# Altium schematic sheet ZOWI_Main_Board.SchDoc: ZOWI_Main_Board
size A4; Author: Raúl de Pablos; CompanyName: bq - Mundo Reader; Organization: bq - Mundo Reader; DocumentNumber: 1; Revision: 1.0; SheetNumber: 1; SheetTotal: 9
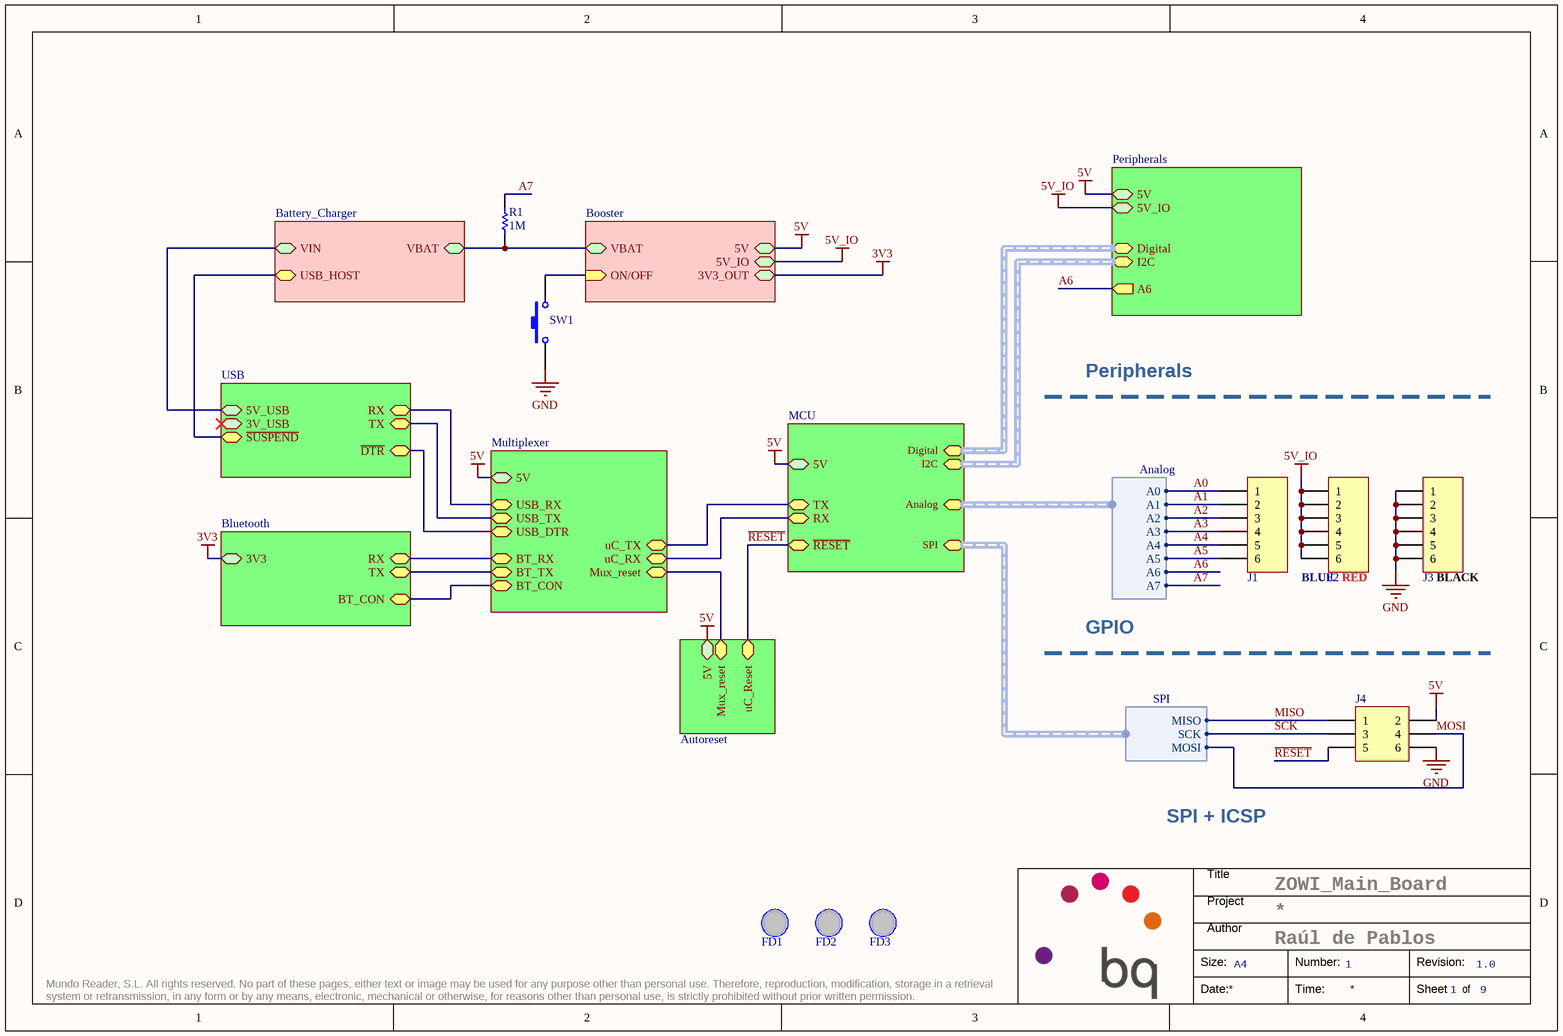
[diagram p0: ZOWI_Main_Board.SchDoc]

## Parts
FD1  Fiducial  [Fiducial_1mm]  (value not drawn)  (no BOM)
FD2  Fiducial  [Fiducial_1mm]  (value not drawn)  (no BOM)
FD3  Fiducial  [Fiducial_1mm]  (value not drawn)  (no BOM)
J1  1x6 pin Header 2.54mm  [1x6 Pin Header 2.54]  (value not drawn)
J2  1x6 pin Header 2.54mm  [1x6 Pin Header 2.54]  (value not drawn)
J3  1x6 pin Header 2.54mm  [1x6 Pin Header 2.54]  (value not drawn)
J4  2x3 pin Header 2.54mm  [2x3 Pin Header 2.54]  (value not drawn)
R1  Resistance: 1M  [R0402]  (hidden comment: Resistor)
SW1  Switch  [MJTP1105T]  (value not drawn)

## Sub-sheets
Autoreset = ZOWI_Main_Board_Autoreset.SchDoc: Mux_reset, uC_Reset, 5V
Battery_Charger = ZOWI_Main_Board_Battery_Charger.SchDoc: VIN, USB_HOST, VBAT
Bluetooth = ZOWI_Main_Board_Bluetooth.SchDoc: RX, TX, BT_CON, 3V3
Booster = ZOWI_Main_Board_Booster.SchDoc: VBAT, 5V, 3V3_OUT, ON/OFF (in), 5V_IO
MCU = ZOWI_Main_Board_MCU.SchDoc: 5V, Analog (harness Analog), Digital (harness Digital), SPI (harness SPI), ~{RESET}, TX, RX, I2C (harness I2C)
Multiplexer = ZOWI_Main_Board_Multiplexer.SchDoc: 5V, USB_TX, USB_RX, BT_TX, BT_RX, BT_CON, USB_DTR, uC_TX, uC_RX, Mux_reset
Peripherals = ZOWI_Main_Board_Peripherals.SchDoc: Digital, A6 (out), 5V, 5V_IO, I2C
USB = ZOWI_Main_Board_USB.SchDoc: RX, TX, ~{DTR}, ~{SUSPEND}, 5V_USB, 3V_USB

## Harnesses
SPI: SCK, MISO, MOSI
Analog: A0, A1, A2, A3, A4, A5, A6, A7

## Nets
3V3: sheet Bluetooth/3V3, sheet Booster/3V3_OUT
5V: J4.2 ; sheet MCU/5V, sheet Booster/5V, sheet Multiplexer/5V, sheet Peripherals/5V, sheet Autoreset/5V
5V_IO: J2.1 J2.2 J2.3 J2.4 J2.5 J2.6 ; sheet Booster/5V_IO, sheet Peripherals/5V_IO
GND: J3.1 J3.2 J3.3 J3.4 J3.5 J3.6 J4.6 SW1.1
A0: J1.1 ; sheet MCU/Analog.A0
A1: J1.2 ; sheet MCU/Analog.A1
A2: J1.3 ; sheet MCU/Analog.A2
A3: J1.4 ; sheet MCU/Analog.A3
A4: J1.5 ; sheet MCU/Analog.A4
A5: J1.6 ; sheet MCU/Analog.A5
A6: sheet Peripherals/A6, sheet MCU/Analog.A6
A7: R1.1 ; sheet MCU/Analog.A7
MISO: J4.1 ; sheet MCU/SPI.MISO
MOSI: J4.4 ; sheet MCU/SPI.MOSI
~{RESET}: J4.5 ; sheet MCU/~{RESET}, sheet Autoreset/uC_Reset
SCK: J4.3 ; sheet MCU/SPI.SCK
NetR1_2: R1.2 ; sheet Battery_Charger/VBAT, sheet Booster/VBAT
NetSW1_2: SW1.2 ; sheet Booster/ON/OFF
(unnamed): sheet MCU/TX, sheet Multiplexer/uC_TX
(unnamed): sheet MCU/RX, sheet Multiplexer/uC_RX
(unnamed): sheet USB/RX, sheet Multiplexer/USB_RX
(unnamed): sheet USB/TX, sheet Multiplexer/USB_TX
(unnamed): sheet USB/~{DTR}, sheet Multiplexer/USB_DTR
(unnamed): sheet USB/~{SUSPEND}, sheet Battery_Charger/USB_HOST
(unnamed): sheet USB/5V_USB, sheet Battery_Charger/VIN
(unnamed): sheet Bluetooth/RX, sheet Multiplexer/BT_RX
(unnamed): sheet Bluetooth/TX, sheet Multiplexer/BT_TX
(unnamed): sheet Bluetooth/BT_CON, sheet Multiplexer/BT_CON
(unnamed): sheet Multiplexer/Mux_reset, sheet Autoreset/Mux_reset

## Buses and harness runs
harness sheet MCU/Digital = sheet Peripherals/Digital
harness sheet MCU/I2C = sheet Peripherals/I2C

## Notes on the sheet
- Peripherals
- BLUE
- (near J2) RED
- (near J3) BLACK
- GPIO
- SPI + ICSP
- Title
- Project
- Size:
- Author
- A4
- Number:
- Revision:
- Mundo Reader, S.L. All rights reserved. No part of these pages, either text or image may be used for any purpose other than personal use. Therefore, reproduction, modification, storage in a retrieval system or retransmission, in any form or by any means, electronic, mechanical or otherwise, for reasons other than personal use, is strictly prohibited without prior written permission.
- Date:
- Time:
- Sheet
- of

## Library data of the parts
FD1-FD3 = Fiducial 1mm: Fiducial Mark; Part Number: Fiducial 1mm
J1 = CON_PH_THT2.54_6 Blue: Connector, 1x6 pin Header 2.54mm; Manufacturer: Samtec; OrderingCode: TSW-106-07-T-S-BLUE; Temp_ Max: 105; Temp_ Min: -55; Pitch: 2.54mm; Part Number: CON_PH_THT2.54_6 Blue
J2 = CON_PH_THT2.54_6 Red: Connector, 1x6 pin Header 2.54mm; Manufacturer: Samtec; OrderingCode: TSW-106-07-T-S-RED; Temp_ Max: 105; Temp_ Min: -55; Pitch: 2.54mm; Part Number: CON_PH_THT2.54_6 Red
J3 = CON_PH_THT2.54_6: Connector, 1x6 pin Header 2.54mm; Manufacturer: Samtec; OrderingCode: TSW-106-07-T-S; Temp_ Max: 105; Temp_ Min: -55; OrderingCode 2: 613 006 111 21; Value: 6; Pitch: 2.54mm; Part Number: CON_PH_THT2.54_6; Manufacturer 2: Würth Elektronik
J4 = CON_DPH_THT2.54_6: Connector, 6 pin Dual Header 2.54mm; Manufacturer: Samtec; OrderingCode: TSW-103-07-T-D; Temp_ Max: 125; Temp_ Min: -40; OrderingCode 2: 613 006 211 21; Value: 6; Pitch: 2.54mm; Part Number: CON_DPH_THT2.54_6; Manufacturer 2: Würth Elektronik
R1 = R0402_1M_0.063W_±5%: Resistor, SMD; Manufacturer: Vishay; Tolerance: ±5%; OrderingCode: CRCW04021M00JNED; Power: 0.063W; Value: 1M ±5% 0.063W; Temp_ Max: 155; Temp_ Min: -55; PackageDescription: SMD; Part Number: R0402_1M_0.063W_±5%
SW1 = MJTP1105T: Micro miniature pushbutton surface Switch; Manufacturer: APEM; Temp_ Max: 70; Temp_ Min: -20; Part Number: MJTP1105T; OrderingCode: MJTP1105T